# EasyEDA schematic section1.json
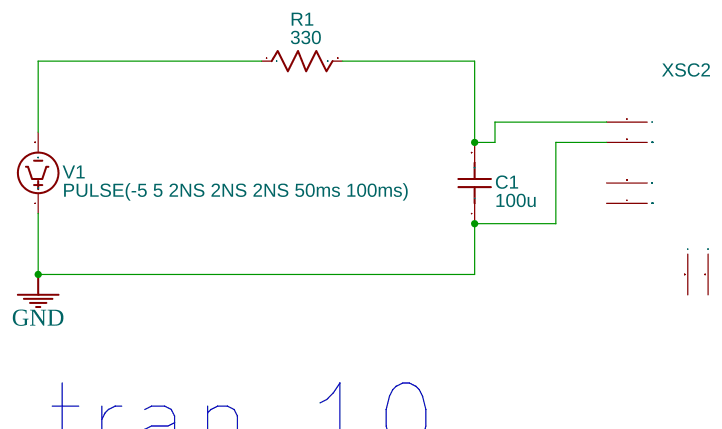
[diagram p0: schematic sheet]

## Parts
C1  100u  [RAD-0.1]
R1  330  [AXIAL-0.3]
V1  PULSE(-5 5 2NS 2NS 2NS 50ms 100ms)  [HDR1X2]
XSC2  Oscilloscope

## Library data of the parts
C1 = Capacitor_US: Contributor: EasyEDA; Supplier: YUJING; Capacitance: 1u
R1 = Resistor_US: Resistance: 1k; Contributor: EasyEDA; Supplier: YUJING
V1 = VPULSE: Contributor: EasyEDA; sim: true
XSC2 = OSCILLOSCOPE: Contributor: EasyEDA; NameDisplay: 0; sim: true

## Nets
GND: C1.1 V1.1 XSC2.2(GND1)
Net-(C1-2): C1.2 R1.2 XSC2.1(A)
Net-(R1-1): R1.1 V1.2

Not connected (* = marked no-connect by the designer): XSC2 3(B) 4(GND2) 5(T+) 6(T-)

## Notes on the sheet
- .tran 10
